# Altium schematic sheet Connections.SchDoc
size 297 x 209 mm
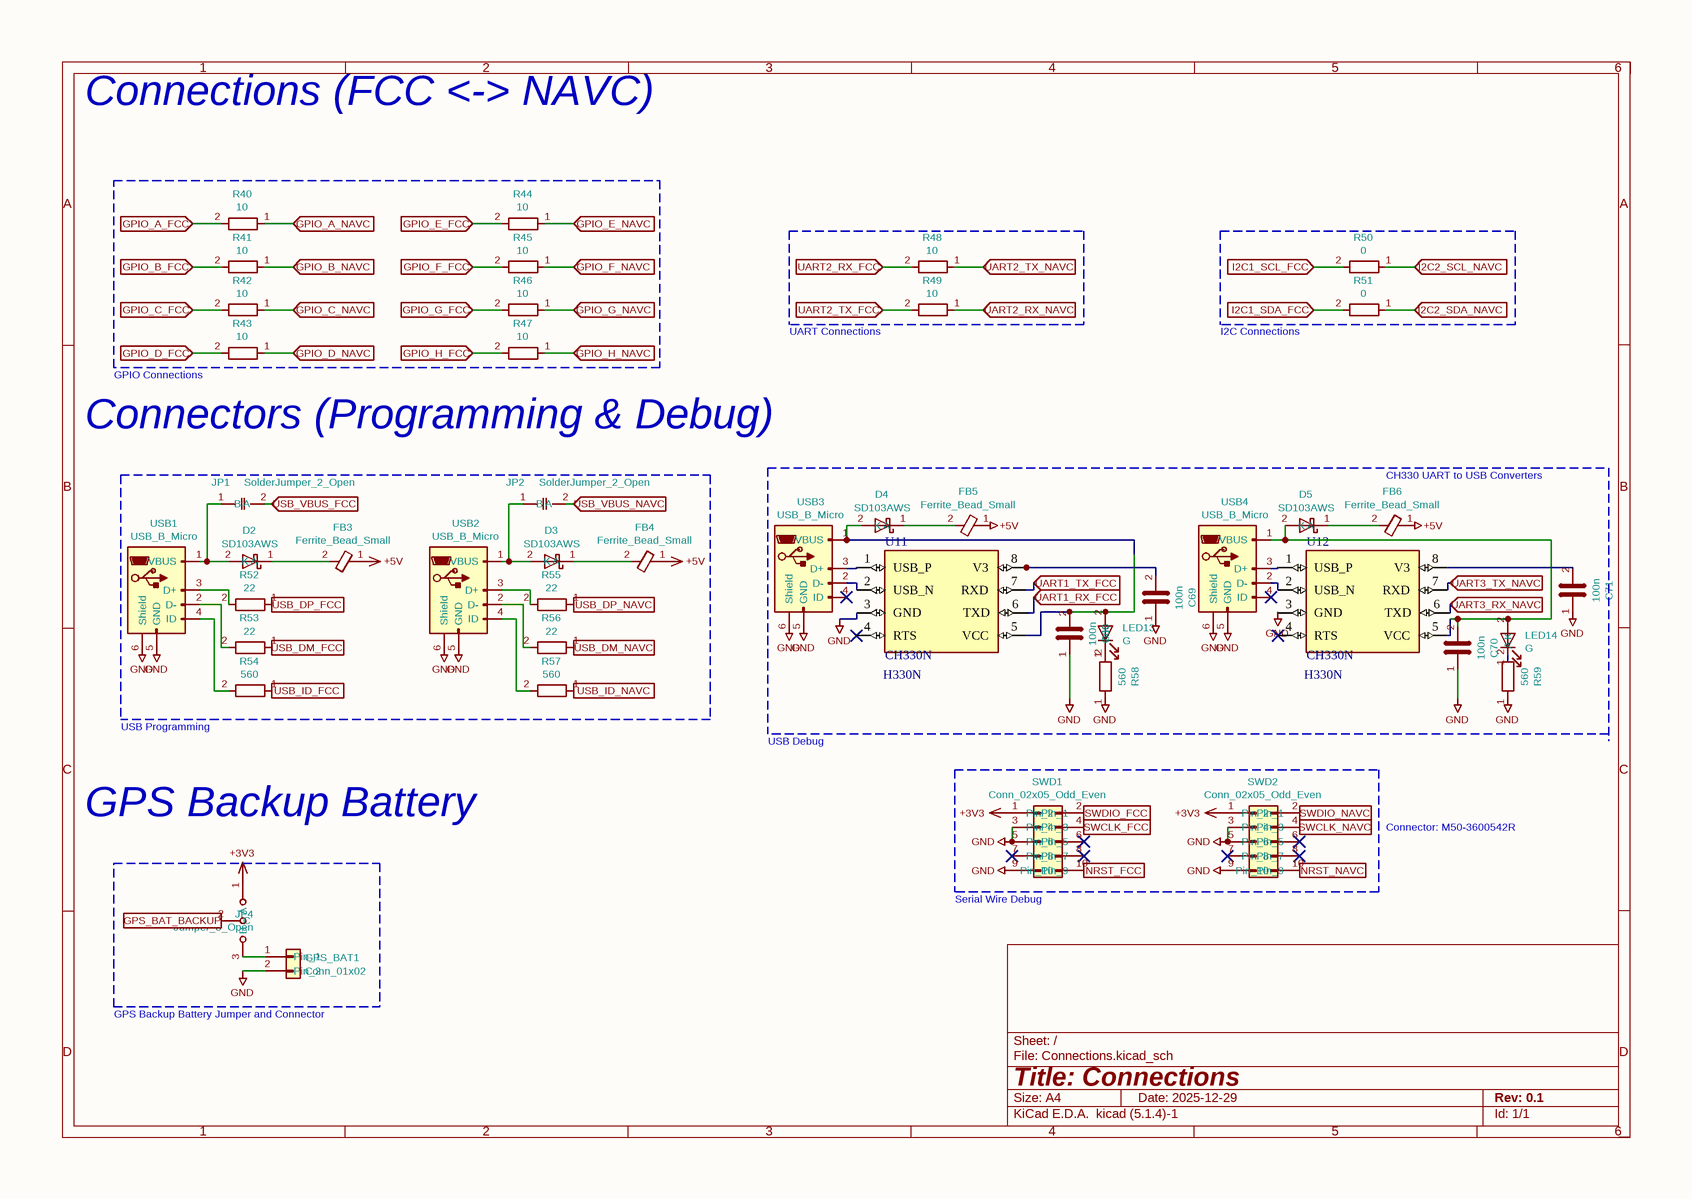
[diagram p0: Connections.SchDoc]

## Parts
C68  100n  [C_0402_1005Metric]
C69  100n  [C_0402_1005Metric]
C70  100n  [C_0402_1005Metric]
C71  100n  [C_0402_1005Metric]
D2  SD103AWS  [D_SOD-323]
D3  SD103AWS  [D_SOD-323]
D4  SD103AWS  [D_SOD-323]
D5  SD103AWS  [D_SOD-323]
FB3  Ferrite_Bead_Small  [L_0402_1005Metric]
FB4  Ferrite_Bead_Small  [L_0402_1005Metric]
FB5  Ferrite_Bead_Small  [L_0402_1005Metric]
FB6  Ferrite_Bead_Small  [L_0402_1005Metric]
GPS_BAT1  Conn_01x02  [Molex_PicoBlade_53048-0210_1x02_P1.25mm_Horizontal]
JP1  SolderJumper_2_Open  [SolderJumper-2_P1.3mm_Open_RoundedPad1.0x1.5mm]
JP2  SolderJumper_2_Open  [SolderJumper-2_P1.3mm_Open_RoundedPad1.0x1.5mm]
JP4  Jumper_3_Open  [SolderJumper-3_P1.3mm_Open_RoundedPad1.0x1.5mm]
LED13  G  [LED_0603_1608Metric]
LED14  G  [LED_0603_1608Metric]
R40  10  [R_0402_1005Metric]
R41  10  [R_0402_1005Metric]
R42  10  [R_0402_1005Metric]
R43  10  [R_0402_1005Metric]
R44  10  [R_0402_1005Metric]
R45  10  [R_0402_1005Metric]
R46  10  [R_0402_1005Metric]
R47  10  [R_0402_1005Metric]
R48  10  [R_0402_1005Metric]
R49  10  [R_0402_1005Metric]
R50  0  [R_0603_1608Metric]
R51  0  [R_0603_1608Metric]
R52  22  [R_0402_1005Metric]
R53  22  [R_0402_1005Metric]
R54  560  [R_0402_1005Metric]
R55  22  [R_0402_1005Metric]
R56  22  [R_0402_1005Metric]
R57  560  [R_0402_1005Metric]
R58  560  [R_0603_1608Metric]
R59  560  [R_0603_1608Metric]
SWD1  Conn_02x05_Odd_Even  [PinHeader_2x05_P1.27mm_Vertical_SMD]
SWD2  Conn_02x05_Odd_Even  [PinHeader_2x05_P1.27mm_Vertical_SMD]
U11  H330N  [8-SOIC]
U12  H330N  [8-SOIC]
USB1  USB_B_Micro  [USB_Micro-B_Wuerth_629105150521_CircularHoles]
USB2  USB_B_Micro  [USB_Micro-B_Wuerth_629105150521_CircularHoles]
USB3  USB_B_Micro  [USB_Micro-B_Wuerth_629105150521_CircularHoles]
USB4  USB_B_Micro  [USB_Micro-B_Wuerth_629105150521_CircularHoles]

## Ports
GPIO_A_FCC (in), GPIO_A_NAVC (in), GPIO_B_FCC (in), GPIO_B_NAVC (in), GPIO_C_FCC (in), GPIO_C_NAVC (in), GPIO_D_FCC (in), GPIO_D_NAVC (in), GPIO_E_FCC (in), GPIO_E_NAVC (in), GPIO_F_FCC (in), GPIO_F_NAVC (in), GPIO_G_FCC (in), GPIO_G_NAVC (in), GPIO_H_FCC (in), GPIO_H_NAVC (in), GPS_BAT_BACKUP (in), I2C1_SCL_FCC (in), I2C1_SDA_FCC (in), I2C2_SCL_NAVC (in), I2C2_SDA_NAVC (in), NRST_FCC (in), NRST_NAVC (in), SWCLK_FCC (in), SWCLK_NAVC (in), SWDIO_FCC (in), SWDIO_NAVC (in), UART1_RX_FCC (in), UART1_TX_FCC (in), UART2_RX_FCC (in), UART2_RX_NAVC (in), UART2_TX_FCC (in), UART2_TX_NAVC (in), UART3_RX_NAVC (in), UART3_TX_NAVC (in), USB_DM_FCC (in), USB_DM_NAVC (in), USB_DP_FCC (in), USB_DP_NAVC (in), USB_ID_FCC (in), USB_ID_NAVC (in), USB_VBUS_FCC (in), USB_VBUS_NAVC (in)

## Nets
+3V3: JP4.1(A) SWD1.1(Pin_1) SWD2.1(Pin_1)
+5V: FB3.1 FB4.1 FB5.1 FB6.1
GND: C68.1 C69.1 C70.1 C71.1 GPS_BAT1.2(Pin_2) R58.1 R59.1 SWD1.3(Pin_3) SWD1.5(Pin_5) SWD1.9(Pin_9) SWD2.3(Pin_3) SWD2.5(Pin_5) SWD2.9(Pin_9) U11.3(GND) USB1.5(GND) USB1.6(Shield) USB2.5(GND) USB2.6(Shield) USB3.5(GND) USB3.6(Shield) USB4.5(GND) USB4.6(Shield)
GPIO_A_FCC: R40.2 ; port GPIO_A_FCC
GPIO_A_NAVC: R40.1 ; port GPIO_A_NAVC
GPIO_B_FCC: R41.2 ; port GPIO_B_FCC
GPIO_B_NAVC: R41.1 ; port GPIO_B_NAVC
GPIO_C_FCC: R42.2 ; port GPIO_C_FCC
GPIO_C_NAVC: R42.1 ; port GPIO_C_NAVC
GPIO_D_FCC: R43.2 ; port GPIO_D_FCC
GPIO_D_NAVC: R43.1 ; port GPIO_D_NAVC
GPIO_E_FCC: R44.2 ; port GPIO_E_FCC
GPIO_E_NAVC: R44.1 ; port GPIO_E_NAVC
GPIO_F_FCC: R45.2 ; port GPIO_F_FCC
GPIO_F_NAVC: R45.1 ; port GPIO_F_NAVC
GPIO_G_FCC: R46.2 ; port GPIO_G_FCC
GPIO_G_NAVC: R46.1 ; port GPIO_G_NAVC
GPIO_H_FCC: R47.2 ; port GPIO_H_FCC
GPIO_H_NAVC: R47.1 ; port GPIO_H_NAVC
GPS_BAT_BACKUP: JP4.2(C) ; port GPS_BAT_BACKUP
I2C1_SCL_FCC: R50.2 ; port I2C1_SCL_FCC
I2C1_SDA_FCC: R51.2 ; port I2C1_SDA_FCC
I2C2_SCL_NAVC: R50.1 ; port I2C2_SCL_NAVC
I2C2_SDA_NAVC: R51.1 ; port I2C2_SDA_NAVC
NRST_FCC: SWD1.10(Pin_10) ; port NRST_FCC
NRST_NAVC: SWD2.10(Pin_10) ; port NRST_NAVC
SWCLK_FCC: SWD1.4(Pin_4) ; port SWCLK_FCC
SWCLK_NAVC: SWD2.4(Pin_4) ; port SWCLK_NAVC
SWDIO_FCC: SWD1.2(Pin_2) ; port SWDIO_FCC
SWDIO_NAVC: SWD2.2(Pin_2) ; port SWDIO_NAVC
UART1_RX_FCC: U11.6(TXD) ; port UART1_RX_FCC
UART1_TX_FCC: U11.7(RXD) ; port UART1_TX_FCC
UART2_RX_FCC: R48.2 ; port UART2_RX_FCC
UART2_RX_NAVC: R49.1 ; port UART2_RX_NAVC
UART2_TX_FCC: R49.2 ; port UART2_TX_FCC
UART2_TX_NAVC: R48.1 ; port UART2_TX_NAVC
UART3_RX_NAVC: U12.6(TXD) ; port UART3_RX_NAVC
UART3_TX_NAVC: U12.7(RXD) ; port UART3_TX_NAVC
USB_DM_FCC: R53.1 ; port USB_DM_FCC
USB_DM_NAVC: R56.1 ; port USB_DM_NAVC
USB_DP_FCC: R52.1 ; port USB_DP_FCC
USB_DP_NAVC: R55.1 ; port USB_DP_NAVC
USB_ID_FCC: R54.1 ; port USB_ID_FCC
USB_ID_NAVC: R57.1 ; port USB_ID_NAVC
USB_VBUS_FCC: JP1.2(B) ; port USB_VBUS_FCC
USB_VBUS_NAVC: JP2.2(B) ; port USB_VBUS_NAVC
NetC68_2: C68.2 D4.2(A) LED13.2(A) U11.5(VCC) USB3.1(VBUS)
NetC69_2: C69.2 U11.8(V3)
NetC70_2: C70.2 D5.2(A) LED14.2(A) U12.5(VCC) USB4.1(VBUS)
NetC71_2: C71.2 U12.8(V3)
NetD2_1: D2.1(K) FB3.2
NetD2_2: D2.2(A) JP1.1(A) USB1.1(VBUS)
NetD3_1: D3.1(K) FB4.2
NetD3_2: D3.2(A) JP2.1(A) USB2.1(VBUS)
NetD4_1: D4.1(K) FB5.2
NetD5_1: D5.1(K) FB6.2
NetGPS_BAT1_1: GPS_BAT1.1(Pin_1) JP4.3(B)
NetLED13_1: LED13.1(K) R58.2
NetLED14_1: LED14.1(K) R59.2
NetR52_2: R52.2 USB1.3(D+)
NetR53_2: R53.2 USB1.2(D-)
NetR54_2: R54.2 USB1.4(ID)
NetR55_2: R55.2 USB2.3(D+)
NetR56_2: R56.2 USB2.2(D-)
NetR57_2: R57.2 USB2.4(ID)
NetU11_1: U11.1(USB_P) USB3.3(D+)
NetU11_2: U11.2(USB_N) USB3.2(D-)
NetU12_1: U12.1(USB_P) USB4.3(D+)
NetU12_2: U12.2(USB_N) USB4.2(D-)

Not connected (* = marked no-connect by the designer): SWD1 6(Pin_6)* 7(Pin_7)* 8(Pin_8)*; SWD2 6(Pin_6)* 7(Pin_7)* 8(Pin_8)*; U11 4(RTS)*; U12 3(GND) 4(RTS)*; USB3 4(ID)*; USB4 4(ID)*

## Notes on the sheet
- Connections (FCC <-> NAVC)
- UART Connections
- I2C Connections
- (near R43) GPIO Connections
- Connectors (Programming & Debug)
- (near FB6) CH330 UART to USB Converters
- (near R54) USB Programming
- USB Debug
- GPS Backup Battery
- Connector: M50-3600542R
- (near SWD1) Serial Wire Debug
- (near GPS_BAT1) GPS Backup Battery Jumper and Connector
- Labels drawn without touching a wire or pin: GND
- 1
- 2
- 3
- 4
- 5
- 6
- A
- B
- C
- D
- Title: Connections
- File: Connections.kicad_sch
- Sheet: /
- KiCad E.D.A.  kicad (5.1.4)-1
- Size: A4
- Date: 2025-12-29
- Rev: 0.1
- Id: 1/1

## Library data of the parts
C68-C71 = C: Value: 100n; Footprint: Capacitor_SMD:C_0402_1005Metric
D2-D5 = D_Schottky: Value: SD103AWS; Footprint: Diode_SMD:D_SOD-323
FB3-FB6 = Ferrite_Bead_Small-Device: Value: Ferrite_Bead_Small; Footprint: Inductor_SMD:L_0402_1005Metric
JP4 = Jumper_3_Open-Jumper: Value: Jumper_3_Open; Footprint: Jumper:SolderJumper-3_P1.3mm_Open_RoundedPad1.0x1.5mm
LED13 LED14 = LED: Value: G; Footprint: LED_SMD:LED_0603_1608Metric
R40-R59 = R
  R40-R49: Value: 10; Footprint: Resistor_SMD:R_0402_1005Metric
  R50 R51: Value: 0; Footprint: Resistor_SMD:R_0603_1608Metric
  R52 R53 R55 R56: Value: 22; Footprint: Resistor_SMD:R_0402_1005Metric
  R54 R57: Value: 560; Footprint: Resistor_SMD:R_0402_1005Metric
  R58 R59: Value: 560; Footprint: Resistor_SMD:R_0603_1608Metric
U11 U12 = CH330N: USB To Serial Chip; MF: WCH; MP: CH330N; Price: None; Package: Package; Availability: Not in stock; Check_prices: https://www.snapeda.com/parts/CH330N/WCH/view-part/?ref=eda; SnapEDA_Link: https://www.snapeda.com/parts/CH330N/WCH/view-part/?ref=snap; Value: *
USB1-USB4 = USB_B_Micro-Connector: Value: USB_B_Micro; Footprint: Connector_USB:USB_Micro-B_Wuerth_629105150521_CircularHoles
GPS_BAT1 = Conn_01x02: Value: Conn_01x02; Footprint: Connector_Molex:Molex_PicoBlade_53048-0210_1x02_P1.25mm_Horizontal
JP1 JP2 = SolderJumper_2_Open: Value: SolderJumper_2_Open; Footprint: Jumper:SolderJumper-2_P1.3mm_Open_RoundedPad1.0x1.5mm
SWD1 SWD2 = Conn_02x05_Odd_Even: Value: Conn_02x05_Odd_Even; Footprint: Connector_PinHeader_1.27mm:PinHeader_2x05_P1.27mm_Vertical_SMD